# EAGLE schematic XTIDE-CPLD-3V3-v2 (EAGLE 5.07)
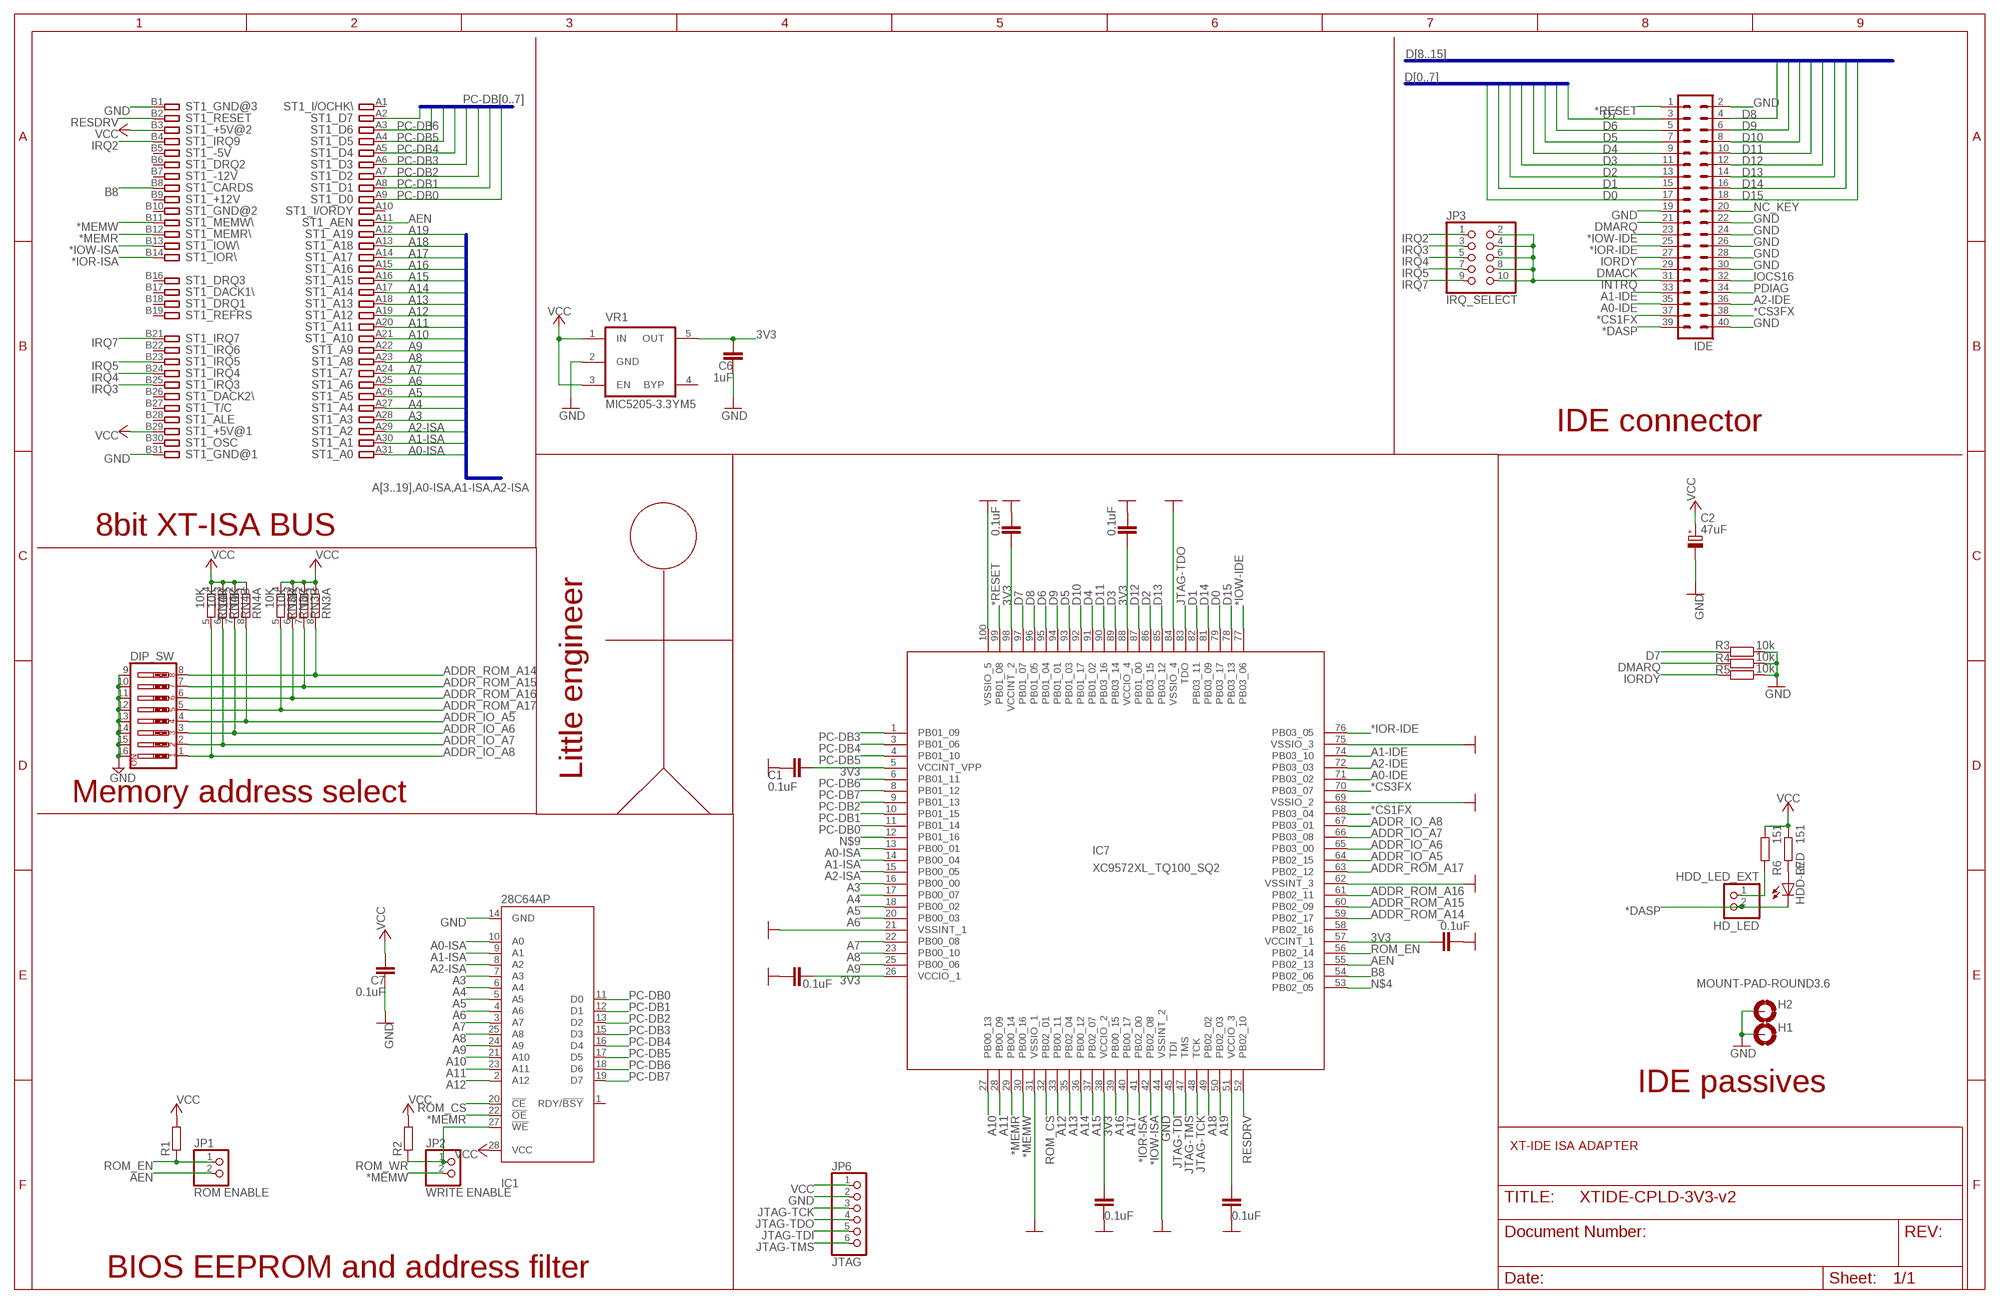
[diagram p0: schematic, sheet 1, part 1 of 2]
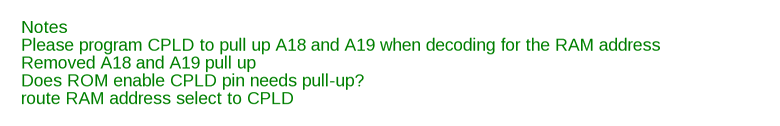
[diagram p1: schematic, sheet 1, part 2 of 2]

## Parts
C1  0.1uF  C-EUC0603  [C0603]
C2  47uF  CPOL-EUSANYO_SMD_A5  [SANYO-OSCON_SMD_A5]
C3  0.1uF  C-EUC0603  [C0603]
C4  0.1uF  C-EUC0603  [C0603]
C6  1uF  C-EUC0603  [C0603]
C7  0.1uF  C-EUC0603  [C0603]
C8  0.1uF  C-EUC0603  [C0603]
C9  0.1uF  C-EUC0603  [C0603]
C10  0.1uF  C-EUC0603  [C0603]
C11  0.1uF  C-EUC0603  [C0603]
DIP_SW  SW_DIP-8  [EDG-08]
H1  MOUNT-PAD-ROUND3.6  [3,6-PAD]
H2  MOUNT-PAD-ROUND3.6  [3,6-PAD]
HDD-LED  LEDCHIPLED_0805  [CHIPLED_0805]
HDD_LED_EXT  HD_LED  PINHD-1X02_2.54-S  [1X02-S]
IC1  28C64AP  [DIL28-6]
IC7  XC9572XL_TQ100_SQ2  [VQ100]
IDE  MA20-2  [MA20-2]
JP1  ROM ENABLE  PINHD-1X02_2.54-S  [1X02-S]
JP2  WRITE ENABLE  PINHD-1X02_2.54-S  [1X02-S]
JP3  IRQ_SELECT  PINHD-2X05_2.54  [2X05]
JP6  JTAG  PINHD-1X06_2.54-S  [1X06-S]
R1  R-EU_R0603  [R0603]
R2  R-EU_R0603  [R0603]
R3  10k  R-EU_R0603  [R0603]
R4  10k  R-EU_R0603  [R0603]
R5  10k  R-EU_R0603  [R0603]
R6  151  R-EU_R0603  [R0603]
R7  151  R-EU_R0603  [R0603]
RN3  10K  RNETWORK  [RN8P-4R-CRA06S]
RN4  10K  RNETWORK  [RN8P-4R-CRA06S]
ST1  IBM8BIT  [IBM8BIT]
VR1  MIC5205-3.3YM5  MIC5205  [SOT-23-5]

## Nets
3V3: C1.2 C3.2 C4.2 C6.2 C8.2 C9.2 C10.2 C11.2 IC7.5(VCCINT_VPP) IC7.26(VCCIO_1) IC7.38(VCCIO_2) IC7.51(VCCIO_3) IC7.57(VCCINT_1) IC7.88(VCCIO_4) IC7.98(VCCINT_2) VR1.5(OUT)
*CS1FX: IC7.68(PB03_04) IDE.37
*CS3FX: IC7.70(PB03_07) IDE.38
*DASP: HDD-LED.C HDD_LED_EXT.2 IDE.39
*IOR-IDE: IC7.76(PB03_05) IDE.25
*IOR-ISA: IC7.41(PB02_00) ST1.B14
*IOW-IDE: IC7.77(PB03_06) IDE.23
*IOW-ISA: IC7.42(PB02_08) ST1.B13
*MEMR: IC1.22(!OE) IC7.29(PB00_14) ST1.B12
*MEMW: IC7.30(PB00_16) JP2.2 ST1.B11
*RESET: IC7.99(PB01_08) IDE.1
A0-IDE: IC7.71(PB03_02) IDE.35
A0-ISA: IC1.10(A0) IC7.13(PB00_01) ST1.A31
A1-IDE: IC7.74(PB03_10) IDE.33
A1-ISA: IC1.9(A1) IC7.14(PB00_04) ST1.A30
A2-IDE: IC7.72(PB03_03) IDE.36
A2-ISA: IC1.8(A2) IC7.15(PB00_05) ST1.A29
A3: IC1.7(A3) IC7.16(PB00_00) ST1.A28
A4: IC1.6(A4) IC7.17(PB00_07) ST1.A27
A5: IC1.5(A5) IC7.18(PB00_02) ST1.A26
A6: IC1.4(A6) IC7.20(PB00_03) ST1.A25
A7: IC1.3(A7) IC7.22(PB00_08) ST1.A24
A8: IC1.25(A8) IC7.23(PB00_10) ST1.A23
A9: IC1.24(A9) IC7.25(PB00_06) ST1.A22
A10: IC1.21(A10) IC7.27(PB00_13) ST1.A21
A11: IC1.23(A11) IC7.28(PB00_09) ST1.A20
A12: IC1.2(A12) IC7.33(PB00_11) ST1.A19
A13: IC7.35(PB02_04) ST1.A18
A14: IC7.36(PB00_12) ST1.A17
A15: IC7.37(PB02_07) ST1.A16
A16: IC7.39(PB00_15) ST1.A15
A17: IC7.40(PB00_17) ST1.A14
A18: IC7.49(PB02_02) ST1.A13
A19: IC7.50(PB02_03) ST1.A12
ADDR_IO_A5: DIP_SW.4 IC7.64(PB02_15) RN4.8
ADDR_IO_A6: DIP_SW.3 IC7.65(PB03_00) RN4.7
ADDR_IO_A7: DIP_SW.2 IC7.66(PB03_08) RN4.6
ADDR_IO_A8: DIP_SW.1 IC7.67(PB03_01) RN4.5
ADDR_ROM_A14: DIP_SW.8 IC7.59(PB02_17) RN3.8
ADDR_ROM_A15: DIP_SW.7 IC7.60(PB02_09) RN3.7
ADDR_ROM_A16: DIP_SW.6 IC7.61(PB02_11) RN3.6
ADDR_ROM_A17: DIP_SW.5 IC7.63(PB02_12) RN3.5
AEN: IC7.55(PB02_13) JP1.2 ST1.A11
B8: IC7.54(PB02_06) ST1.B8
D0: IC7.79(PB03_17) IDE.17
D1: IC7.82(PB03_11) IDE.15
D2: IC7.86(PB03_15) IDE.13
D3: IC7.89(PB03_14) IDE.11
D4: IC7.91(PB01_02) IDE.9
D5: IC7.93(PB01_03) IDE.7
D6: IC7.95(PB01_04) IDE.5
D7: IC7.97(PB01_07) IDE.3 R3.2
D8: IC7.96(PB01_05) IDE.4
D9: IC7.94(PB01_01) IDE.6
D10: IC7.92(PB01_17) IDE.8
D11: IC7.90(PB03_16) IDE.10
D12: IC7.87(PB01_00) IDE.12
D13: IC7.85(PB03_12) IDE.14
D14: IC7.81(PB03_09) IDE.16
D15: IC7.78(PB03_13) IDE.18
DMACK: IDE.29
DMARQ: IDE.21 R4.2
GND: C1.1 C2.- C3.1 C4.1 C6.1 C7.1 C8.1 C9.1 C10.1 C11.1 DIP_SW.9 DIP_SW.10 DIP_SW.11 DIP_SW.12 DIP_SW.13 DIP_SW.14 DIP_SW.15 DIP_SW.16 H1.B3,6(MOUNT) H2.B3,6(MOUNT) IC1.14(GND) IC7.21(VSSINT_1) IC7.31(VSSIO_1) IC7.44(VSSINT_2) IC7.62(VSSINT_3) IC7.69(VSSIO_2) IC7.75(VSSIO_3) IC7.84(VSSIO_4) IC7.100(VSSIO_5) IDE.2 IDE.19 IDE.22 IDE.24 IDE.26 IDE.28 IDE.30 IDE.40 JP6.2 R3.1 R4.1 R5.1 ST1.B1 ST1.B31 VR1.2(GND)
INTRQ: IDE.31 JP3.2 JP3.4 JP3.6 JP3.8 JP3.10
IOCS16: IDE.32
IORDY: IDE.27 R5.2
IRQ2: JP3.1 ST1.B4
IRQ3: JP3.3 ST1.B25
IRQ4: JP3.5 ST1.B24
IRQ5: JP3.7 ST1.B23
IRQ7: JP3.9 ST1.B21
JTAG-TCK: IC7.48(TCK) JP6.3
JTAG-TDI: IC7.45(TDI) JP6.5
JTAG-TDO: IC7.83(TDO) JP6.4
JTAG-TMS: IC7.47(TMS) JP6.6
N$1: HDD-LED.A R7.2
N$4: IC7.53(PB02_05)
N$5: HDD_LED_EXT.1 R6.2
N$9: IC7.12(PB01_16)
NC_KEY: IDE.20
PC-DB0: IC1.11(D0) IC7.11(PB01_14) ST1.A9
PC-DB1: IC1.12(D1) IC7.10(PB01_15) ST1.A8
PC-DB2: IC1.13(D2) IC7.9(PB01_13) ST1.A7
PC-DB3: IC1.15(D3) IC7.1(PB01_09) ST1.A6
PC-DB4: IC1.16(D4) IC7.3(PB01_06) ST1.A5
PC-DB5: IC1.17(D5) IC7.4(PB01_10) ST1.A4
PC-DB6: IC1.18(D6) IC7.6(PB01_11) ST1.A3
PC-DB7: IC1.19(D7) IC7.8(PB01_12) ST1.A2
PDIAG: IDE.34
RESDRV: IC7.52(PB02_10) ST1.B2
ROM_CS: IC1.20(!CE) IC7.32(PB02_01)
ROM_EN: IC7.56(PB02_14) JP1.1 R1.1
ROM_WR: IC1.27(!WE) JP2.1 R2.1
VCC: C2.+ C7.2 IC1.28(VCC) JP6.1 R1.2 R2.2 R6.1 R7.1 RN3.1 RN3.2 RN3.3 RN3.4 RN4.1 RN4.2 RN4.3 RN4.4 ST1.B3 ST1.B29 VR1.1(IN) VR1.3(EN)
Unconnected: IC1.1(RDY/!BSY) IC7.58(PB02_16) ST1.A1 ST1.A10 ST1.B5 ST1.B6 ST1.B7 ST1.B9 ST1.B10 ST1.B15 ST1.B16 ST1.B17 ST1.B18 ST1.B19 ST1.B20 ST1.B22 ST1.B26 ST1.B27 ST1.B28 ST1.B30 VR1.4(BYP)

## Buses
D[0..7]
D[8..15]
PC-DB[0..7]
A[3..19],A0-ISA,A1-ISA,A2-ISA

## Notes on the sheet
- IDE connector
- 8bit XT-ISA BUS
- Little engineer
- Memory address select
- Notes
- Please program CPLD to pull up A18 and A19 when decoding for the RAM address
- Removed A18 and A19 pull up
- Does ROM enable CPLD pin needs pull-up?
- route RAM address select to CPLD
- IDE passives
- XT-IDE ISA ADAPTER
- BIOS EEPROM and address filter

## Library data of the parts
C1 C3 C4 C6-C11 = rcl:C-EU: CAPACITOR, European symbol
C2 = rcl:CPOL-EU: POLARIZED CAPACITOR, European symbol
DIP_SW = special:SW_DIP-8: DIP SWITCH
H1 H2 = holes:MOUNT-PAD-ROUND: MOUNTING PAD, round
HDD-LED = led:LED: LED OSRAM: - CHIPLED LG R971, LG N971, LY N971, LG Q971, LY Q971, LO R971, LY R971 LH N974, LH R974 LS Q976, LO Q976, LY Q976 LO Q996 - Hyper CHIPLED LW Q18S LB Q993, LB Q99A, LB R99A - SideLED LS A670, LO A670, LY A670, LG A670, LP A670 LB A673, LV A673, LT A673, LW A673 LH A674 LY A675 LS A676, LA A676, LO A676, LY A676, LW A676 LS A679, LY A679, LG A679 - Hyper Micro SIDELED® LS Y876, LA Y876, LO Y876, LY Y876 LT Y87S - SmartLED LW L88C, LW L88S LB L89C, LB L89S, LG L890 LS L89K, LO L89K, LY L89K LS L896, LA L896, LO L896, LY L896 - TOPLED LS T670, LO T670, LY T670, LG T670, LP T670 LSG T670, LSP T670, LSY T670, LOP T670, LYG T670 LG T671, LOG T671, LSG T671 LB T673, LV T673, LT T673, LW T673 LH T674 LS T676, LA T676, LO T676, LY T676, LB T676, LH T676, LSB T676, LW T676 LB T67C, LV T67C, LT T67C, LS T67K, LO T67K, LY T67K, LW E67C LS E67B, LA E67B, LO E67B, LY E67B, LB E67C, LV E67C, LT E67C LW T67C LS T679, LY T679, LG T679 LS T770, LO T770, LY T770, LG T770, LP T770 LB T773, LV T773, LT T773, LW T773 LH T774 LS E675, LA E675, LY E675, LS T675 LS T776, LA T776, LO T776, LY T776, LB T776 LHGB T686 LT T68C, LB T68C - Hyper Mini TOPLED® LB M676 - Mini TOPLED Santana® LG M470 LS M47K, LO M47K, LY M47K Source: http://www.osram.convergy.de LUXEON: - LUMILED® LXK2-PW12-R00, LXK2-PW12-S00, LXK2-PW14-U00, LXK2-PW14-V00 LXK2-PM12-R00, LXK2-PM12-S00, LXK2-PM14-U00 LXK2-PE12-Q00, LXK2-PE12-R00, LXK2-PE12-S00, LXK2-PE14-T00, LXK2-PE14-U00 LXK2-PB12-K00, LXK2-PB12-L00, LXK2-PB12-M00, LXK2-PB14-N00, LXK2-PB14-P00, LXK2-PB14-Q00 LXK2-PR12-L00, LXK2-PR12-M00, LXK2-PR14-Q00, LXK2-PR14-R00 LXK2-PD12-Q00, LXK2-PD12-R00, LXK2-PD12-S00 LXK2-PH12-R00, LXK2-PH12-S00 LXK2-PL12-P00, LXK2-PL12-Q00, LXK2-PL12-R00 Source: www.luxeon.com KINGBRIGHT: KA-3528ASYC Source: www.kingbright.com
HDD_LED_EXT JP1 JP2 = pinhead-2:PINHD-1X02: PIN HEADER
IC1 = microchip:28*64A: CMOS EEPROM 64 K (8 K x 8), low voltage
IC7 = dp_devices:XC9572XL_TQ100_SQ2: xc9572xl_tq100 edit this description Auto generated by make-symbol-device-package-bsdl.ulp Rev. 34 Source: xc9572xl_tq100.bsd
IDE = con-lstb:MA20-2: PIN HEADER
JP3 = pinhead-2:PINHD-2X05: PIN HEADER
JP6 = pinhead-2:PINHD-1X06: PIN HEADER
R1-R7 = rcl:R-EU_: RESISTOR, European symbol
RN3 RN4 = dp_devices:RNETWORK: 4 Resistor Array 0603
ST1 = con-pc:IBM8BIT: 8-bit CARD IBM/PC-AT
VR1 = dp_devices:MIC5205: 150ma Low-Noise LDO Regulator